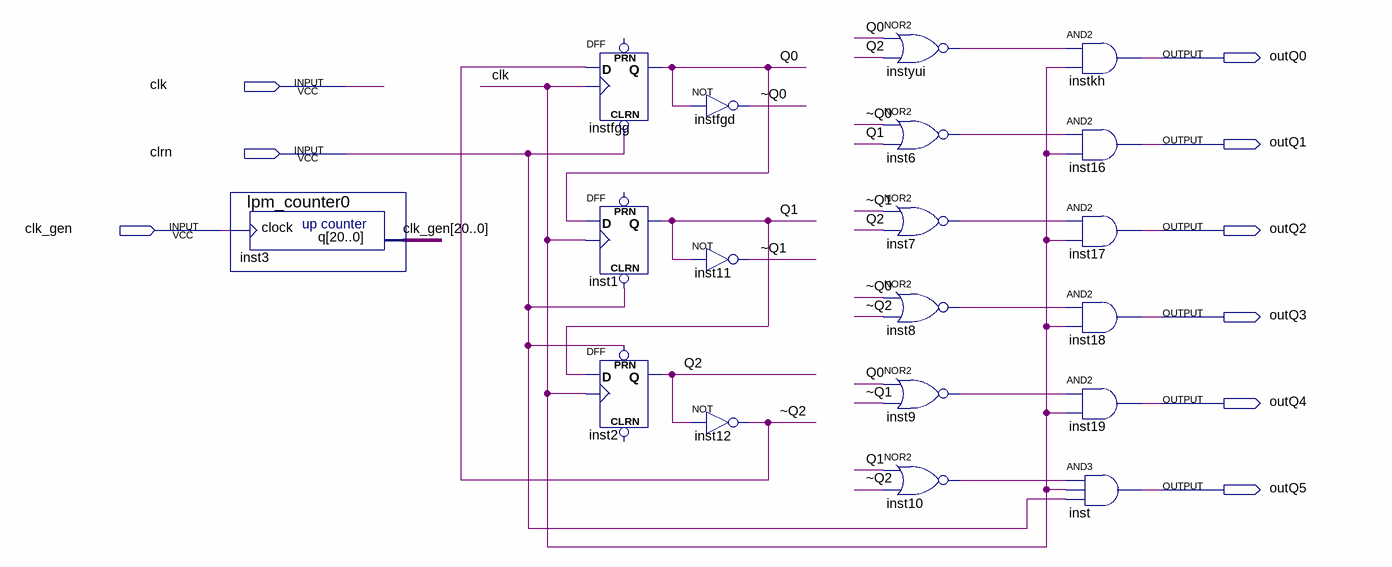
[diagram p0: schematic sheet]
// Quartus schematic lab6part2.bdf as structural Verilog: 19 symbols, 9 pins
module lab6part2 (
  input  clk,
  input  clrn,
  input  clk_gen,
  output outQ0,
  output outQ1,
  output outQ2,
  output outQ3,
  output outQ4,
  output outQ5
);

  wire inst6_out, inst7_out, inst8_out, inst9_out, inst10_out, instyui_out, Q0, Q1, Q2, \~Q0 , \~Q1 , \~Q2 ;
  wire [20:0] clk_gen_bus;

  lpm_counter0 inst3 (.clock(clk_gen), .q(clk_gen_bus));
  DFF instfgg (.CLRN(clrn), .CLK(clk), .D(\~Q2 ), .Q(Q0));  // open: PRN
  DFF inst1 (.CLRN(clrn), .CLK(clk), .D(Q0), .Q(Q1));  // open: PRN
  DFF inst2 (.CLK(clk), .D(Q1), .PRN(clrn), .Q(Q2));  // open: CLRN
  not instfgd (\~Q0 , Q0);
  not inst11 (\~Q1 , Q1);
  not inst12 (\~Q2 , Q2);
  nor instyui (instyui_out, Q0, Q2);
  nor inst6 (inst6_out, \~Q0 , Q1);
  nor inst7 (inst7_out, \~Q1 , Q2);
  nor inst8 (inst8_out, \~Q0 , \~Q2 );
  nor inst9 (inst9_out, Q0, \~Q1 );
  nor inst10 (inst10_out, Q1, \~Q2 );
  and instkh (outQ0, instyui_out, clk);
  and inst16 (outQ1, inst6_out, clk);
  and inst17 (outQ2, inst7_out, clk);
  and inst18 (outQ3, inst8_out, clk);
  and inst19 (outQ4, inst9_out, clk);
  and inst (outQ5, inst10_out, clk, clrn);
endmodule
